# Altium schematic sheet HW_Mechanical_Parts.SchDoc: HW Mechanical parts
size A4; SheetNumber: 8; SheetTotal: 8
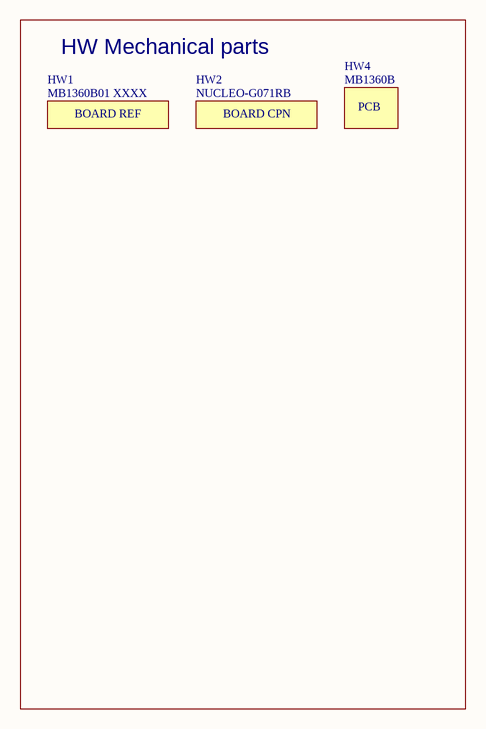
[diagram p0: HW_Mechanical_Parts.SchDoc]

## Parts
HW1  value MB1360B01 XXXX  (hidden comment: STICKER_BOARD_REF)  (mechanical)
HW2  value NUCLEO-G071RB  (hidden comment: STICKER_BOARD_CPN)  (mechanical)
HW4  value MB1360B  (hidden comment: PCB)  (mechanical)

## Blocks framed on the sheet
HW Mechanical parts: HW1 HW2 HW4

## Notes on the sheet
- Title:
- Project:
- Size:
- Revision:
- Variant:
- A4
- Date:
- Reference:
- Sheet:
- of
- (in symbol MCD-00235) BOARD REF
- (in symbol MCD-00549) BOARD CPN

## Library data of the parts
HW1 = MCD-00235: Sticker to mention board reference + serial number; Part_Type: Mechanical; Provided_By: Subcon; Initial_Board_Reference: mb1319; Internal_Part_Number: MCD-00235; ECCN_US: n/a; ECCN_EU: n/a; Status: Released
HW2 = MCD-00549: Sticker to mention board CPN code; Part_Type: Mechanical; Provided_By: Subcon; Initial_Board_Reference: mb1319; Internal_Part_Number: MCD-00549; ECCN_US: n/a; ECCN_EU: n/a; Status: Released
HW4 = MCD-00216: PCB, xxxx for PCB ref, Y for revision; Part_Type: Mechanical; Provided_By: Subcon; Initial_Board_Reference: mb1319; Internal_Part_Number: MCD-00216; Status: Released; ECCN_US: n/a; ECCN_EU: n/a